# Altium project pca10171.PrjPCB (part 2 of 4)

## Sheet pca10171_interface_mcu.SchDoc: =BoardTitle + ' - Interface MCU'
size A3; Organization: Nordic Semiconductor; DocumentNumber: 3; Revision: 1.0.1; SheetNumber: 3; SheetTotal: 10; Author: KOD1; CompanyName: Nordic Semiconductor; DrawnBy: KOD1; DocumentSize: A3; ProjectName: nRF91 DK
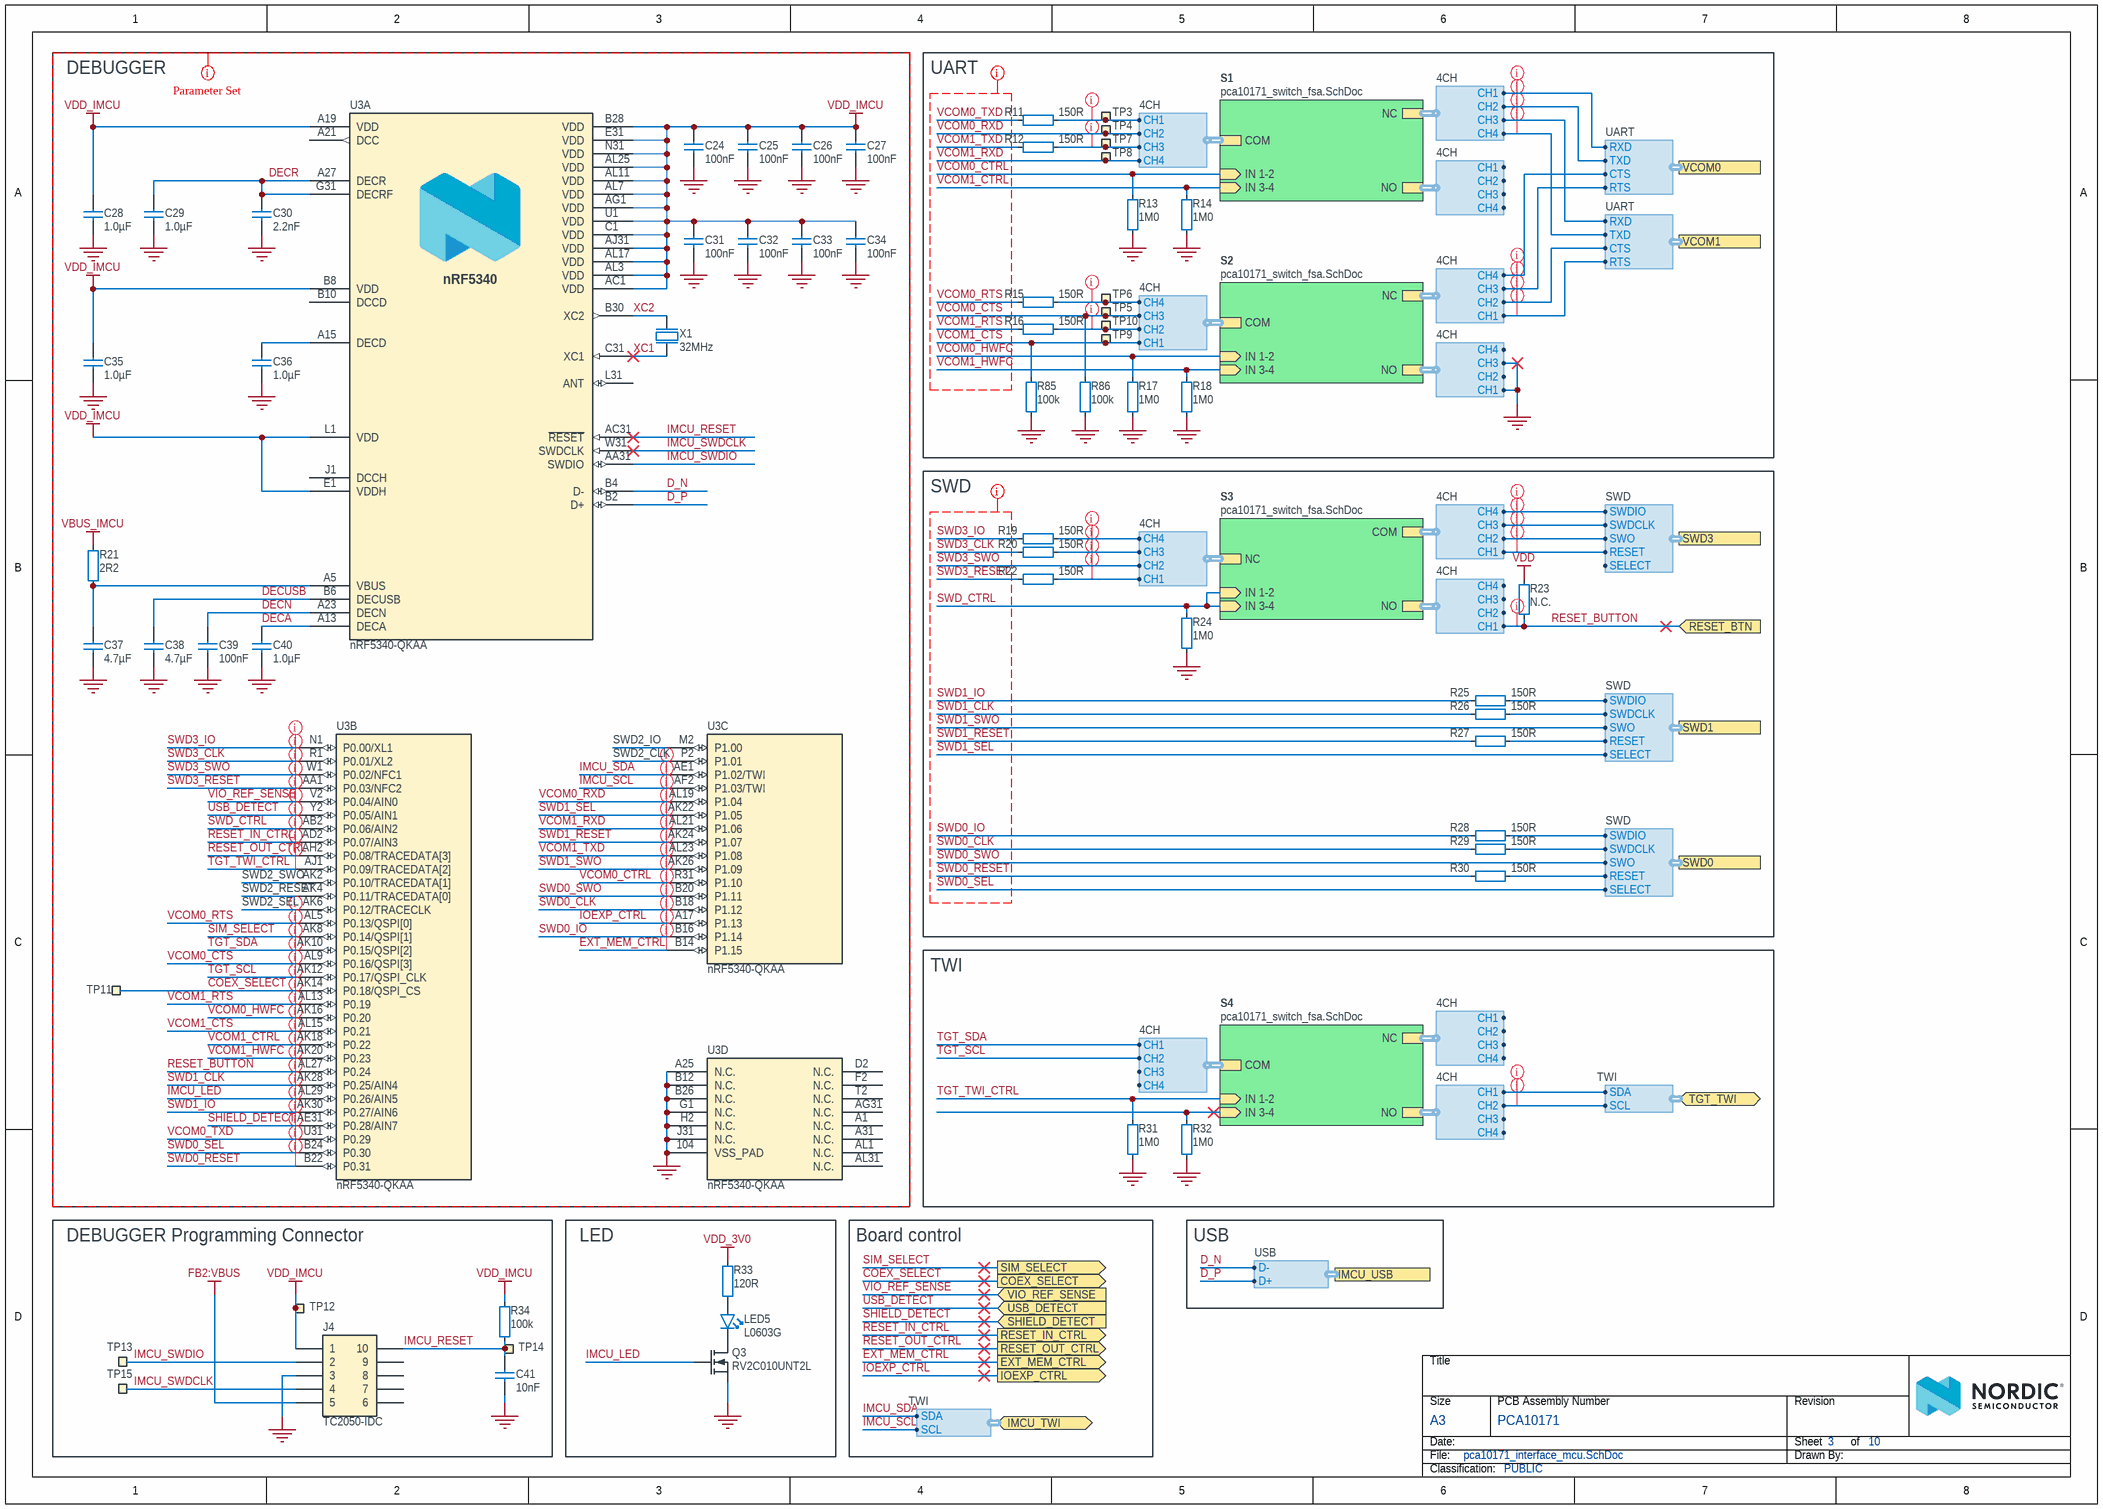
[diagram p2: pca10171_interface_mcu.SchDoc]

### Parts
C24  100nF  [CAPC0603X03L_C]
C25  100nF  [CAPC0603X03L_C]
C26  100nF  [CAPC0603X03L_C]
C27  100nF  [CAPC0603X03L_C]
C28  1.0µF  [CAPC1005X04L]
C29  1.0µF  [CAPC1005X04L]
C30  2.2nF  [CAPC0603X03L_C]
C31  100nF  [CAPC0603X03L_C]
C32  100nF  [CAPC0603X03L_C]
C33  100nF  [CAPC0603X03L_C]
C34  100nF  [CAPC0603X03L_C]
C35  1.0µF  [CAPC1005X04L]
C36  1.0µF  [CAPC1005X04L]
C37  4.7µF  [CAPC1608X06L]
C38  4.7µF  [CAPC1608X06L]
C39  100nF  [CAPC0603X03L_C]
C40  1.0µF  [CAPC1005X04L]
C41  10nF  [CAPC0603X03L_C]
J4  TC2050-IDC  [TC2050-IDC-NLFP]  (no BOM)
LED5  L0603G  [LED_0603_G]
Q3  RV2C010UNT2L  [DFN65P100X40-3L]
R11  150R  [RESC0603X03L_C]
R12  150R  [RESC0603X03L_C]
R13  1M0  [RESC0603X03L_C]
R14  1M0  [RESC0603X03L_C]
R15  150R  [RESC0603X03L_C]
R16  150R  [RESC0603X03L_C]
R17  1M0  [RESC0603X03L_C]
R18  1M0  [RESC0603X03L_C]
R19  150R  [RESC0603X03L_C]
R20  150R  [RESC0603X03L_C]
R21  2R2  [RESC0603X03L_C]
R22  150R  [RESC0603X03L_C]
R23  N.C.  [RESC0603X03L_C_NC]
R24  1M0  [RESC0603X03L_C]
R25  150R  [RESC0603X03L_C]
R26  150R  [RESC0603X03L_C]
R27  150R  [RESC0603X03L_C]
R28  150R  [RESC0603X03L_C]
R29  150R  [RESC0603X03L_C]
R30  150R  [RESC0603X03L_C]
R31  1M0  [RESC0603X03L_C]
R32  1M0  [RESC0603X03L_C]
R33  120R  [RESC0603X03L_C]
R34  100k  [RESC0603X03L_C]
R85  100k  [RESC0603X03L_C]
R86  100k  [RESC0603X03L_C]
TP3  Ø1.5mm,SMD  [TP_SMD_D1.5mm]  (value not drawn)  (no BOM)
TP4  Ø1.5mm,SMD  [TP_SMD_D1.5mm]  (value not drawn)  (no BOM)
TP5  Ø1.5mm,SMD  [TP_SMD_D1.5mm]  (value not drawn)  (no BOM)
TP6  Ø1.5mm,SMD  [TP_SMD_D1.5mm]  (value not drawn)  (no BOM)
TP7  Ø1.5mm,SMD  [TP_SMD_D1.5mm]  (value not drawn)  (no BOM)
TP8  Ø1.5mm,SMD  [TP_SMD_D1.5mm]  (value not drawn)  (no BOM)
TP9  Ø1.5mm,SMD  [TP_SMD_D1.5mm]  (value not drawn)  (no BOM)
TP10  Ø1.5mm,SMD  [TP_SMD_D1.5mm]  (value not drawn)  (no BOM)
TP11  Ø1.5mm,SMD  [TP_SMD_D1.5mm]  (value not drawn)  (no BOM)
TP12  Ø1.5mm,SMD  [TP_SMD_D1.5mm]  (value not drawn)  (no BOM)
TP13  Ø1.5mm,SMD  [TP_SMD_D1.5mm]  (value not drawn)  (no BOM)
TP14  Ø1.5mm,SMD  [TP_SMD_D1.5mm]  (value not drawn)  (no BOM)
TP15  Ø1.5mm,SMD  [TP_SMD_D1.5mm]  (value not drawn)  (no BOM)
U3  nRF5340-QKAA  [AQFN40P700X700X85_HS-99N]  (parts A,B,C,D of 4)
X1  32MHz  [BT-XTAL_2016]

### Blocks framed on the sheet
DEBUGGER: C24-C40 R21 TP11 U3 X1
UART: R11-R18 R85 R86 TP3-TP10
SWD: R19 R20 R22-R30
TWI: R31 R32
DEBUGGER Programming Connector: C41 J4 R34 TP12-TP15
LED: LED5 Q3 R33

### Sub-sheets
S1 = pca10171_switch_fsa.SchDoc: IN 1-2 (in), COM (harness 4CH), NC (harness 4CH), NO (harness 4CH), IN 3-4 (in)
S2 = pca10171_switch_fsa.SchDoc: IN 1-2 (in), COM (harness 4CH), NC (harness 4CH), NO (harness 4CH), IN 3-4 (in)
S3 = pca10171_switch_fsa.SchDoc: IN 1-2 (in), COM (harness 4CH), NC (harness 4CH), NO (harness 4CH), IN 3-4 (in)
S4 = pca10171_switch_fsa.SchDoc: IN 1-2 (in), COM (harness 4CH), NC (harness 4CH), NO (harness 4CH), IN 3-4 (in)

### Ports
COEX_SELECT (out), EXT_MEM_CTRL (out), IMCU_TWI (bidir, harness TWI), IMCU_USB (harness USB), IOEXP_CTRL (out), RESET_BTN (in), RESET_IN_CTRL (out), RESET_OUT_CTRL (out), SHIELD_DETECT (in), SIM_SELECT (out), SWD0 (harness SWD), SWD1 (harness SWD), SWD3 (harness SWD), TGT_TWI (bidir, harness TWI), USB_DETECT (in), VCOM0 (harness UART), VCOM1 (harness UART), VIO_REF_SENSE (in)

### Harnesses
TWI: SCL, SDA
SWD: SWDIO, SWDCLK, SWO, RESET, SELECT
USB: D+, D-
4CH: CH1, CH2, CH3, CH4
UART: RTS, CTS, RXD, TXD

### Nets
FB2:VBUS: J4.5
GND: C24.1 C25.1 C26.2 C27.1 C28.2 C29.1 C30.2 C31.1 C32.1 C33.1 C34.2 C35.1 C36.1 C37.2 C38.2 C39.2 C40.1 C41.1 J4.3 Q3.2(S) R13.2 R14.1 R17.2 R18.1 R24.1 R31.2 R32.1 R85.2 R86.2 U3.104(VSS_PAD) U3.A25(N.C.) U3.B12(N.C.) U3.B26(N.C.) U3.G1(N.C.) U3.H2(N.C.) U3.J31(N.C.) X1.2(GND) X1.4(GND) ; sheet S2/NO.CH1, sheet S2/NO.CH3
VBUS_IMCU: R21.1  [project net VBUS]
VDD: R23.2
VDD_3V0: R33.2
VDD_IMCU: C24.2 C25.2 C26.1 C27.2 C28.1 C31.2 C32.2 C33.2 C34.1 C35.2 J4.1 R34.2 TP12.1 U3.A19(VDD) U3.AC1(VDD) U3.AG1(VDD) U3.AJ31(VDD) U3.AL3(VDD) U3.AL7(VDD) U3.AL11(VDD) U3.AL17(VDD) U3.AL25(VDD) U3.B8(VDD) U3.B28(VDD) U3.C1(VDD) U3.E1(VDDH) U3.E31(VDD) U3.L1(VDD) U3.N31(VDD) U3.U1(VDD)
COEX_SELECT: TP11.1 U3.AK14(P0.18/QSPI_CS) ; port COEX_SELECT
D_N: U3.B4(D-) ; port IMCU_USB.D-
D_P: U3.B2(D+) ; port IMCU_USB.D+
DECA: C40.2 U3.A13(DECA)
DECN: C39.1 U3.A23(DECN)
DECR: C29.2 C30.1 U3.A27(DECR) U3.G31(DECRF)
DECUSB: C38.1 U3.B6(DECUSB)
EXT_MEM_CTRL: U3.B14(P1.15) ; port EXT_MEM_CTRL
IMCU_LED: Q3.1(G) U3.AL29(P0.26/AIN5)
IMCU_RESET: C41.2 J4.10 R34.1 TP14.1 U3.AC31(~{RESET})
IMCU_SCL: U3.AF2(P1.03/TWI) ; port IMCU_TWI.SCL
IMCU_SDA: U3.AE1(P1.02/TWI) ; port IMCU_TWI.SDA
IMCU_SWDCLK: J4.4 TP15.1 U3.W31(SWDCLK)
IMCU_SWDIO: J4.2 TP13.1 U3.AA31(SWDIO)
IN 3-4: R32.2 ; sheet S4/IN 3-4
IOEXP_CTRL: U3.A17(P1.13) ; port IOEXP_CTRL
P0.22: sheet S3/COM.CH2, port SWD3.SWO
P0.30: port TGT_TWI.SDA, sheet S4/NO.CH1
P0.31: port TGT_TWI.SCL, sheet S4/NO.CH2
RESET: sheet S3/COM.CH1, port SWD3.RESET
RESET_BUTTON: R23.1 U3.AL27(P0.24) ; port RESET_BTN, sheet S3/NO.CH1
RESET_IN_CTRL: U3.AD2(P0.07/AIN3) ; port RESET_IN_CTRL
RESET_OUT_CTRL: U3.AH2(P0.08/TRACEDATA[3]) ; port RESET_OUT_CTRL
SHIELD_DETECT: U3.AE31(P0.28/AIN7) ; port SHIELD_DETECT
SIM_SELECT: U3.AK8(P0.14/QSPI[1]) ; port SIM_SELECT
SWD0_CLK: R29.1 U3.B18(P1.12)
SWD0_IO: R28.1 U3.B16(P1.14)
SWD0_RESET: R30.1 U3.B22(P0.31)
SWD0_SEL: U3.B24(P0.30) ; port SWD0.SELECT
SWD0_SWO: U3.B20(P1.11) ; port SWD0.SWO
SWD1_CLK: R26.1 U3.AK28(P0.25/AIN4)
SWD1_IO: R25.1 U3.AK30(P0.27/AIN6)
SWD1_RESET: R27.1 U3.AK24(P1.07)
SWD1_SEL: U3.AK22(P1.05) ; port SWD1.SELECT
SWD1_SWO: U3.AK26(P1.09) ; port SWD1.SWO
SWD3_CLK: R20.1 U3.R1(P0.01/XL2)
SWD3_IO: R19.1 U3.N1(P0.00/XL1)
SWD3_RESET: R22.1 U3.AA1(P0.03/NFC2)
SWD3_SWO: U3.W1(P0.02/NFC1) ; sheet S3/NC.CH2
SWD_CTRL: R24.2 U3.AB2(P0.06/AIN2) ; sheet S3/IN 1-2, sheet S3/IN 3-4
SWDCLK: sheet S3/COM.CH3, port SWD3.SWDCLK
SWDIO: sheet S3/COM.CH4, port SWD3.SWDIO
TGT_SCL: U3.AK12(P0.17/QSPI_CLK) ; sheet S4/COM.CH2
TGT_SDA: U3.AK10(P0.15/QSPI[2]) ; sheet S4/COM.CH1
TGT_TWI_CTRL: R31.1 U3.AJ1(P0.09/TRACEDATA[2]) ; sheet S4/IN 1-2
USB_DETECT: U3.Y2(P0.05/AIN1) ; port USB_DETECT
VCOM0_CTRL: R13.1 U3.R31(P1.10) ; sheet S1/IN 1-2
VCOM0_CTS: R86.1 TP5.1 U3.AL9(P0.16/QSPI[3]) ; sheet S2/COM.CH3
VCOM0_HWFC: R17.1 U3.AK16(P0.20) ; sheet S2/IN 1-2
VCOM0_RTS: R15.1 U3.AL5(P0.13/QSPI[0])
VCOM0_RXD: TP4.1 U3.AL19(P1.04) ; sheet S1/COM.CH2
VCOM0_TXD: R11.1 U3.U31(P0.29)
VCOM1_CTRL: R14.2 U3.AK18(P0.22) ; sheet S1/IN 3-4
VCOM1_CTS: R85.1 TP9.1 U3.AL15(P0.21) ; sheet S2/COM.CH1
VCOM1_HWFC: R18.2 U3.AK20(P0.23) ; sheet S2/IN 3-4
VCOM1_RTS: R16.1 U3.AL13(P0.19)
VCOM1_RXD: TP8.1 U3.AL21(P1.06) ; sheet S1/COM.CH4
VCOM1_TXD: R12.1 U3.AL23(P1.08)
VIO_REF_SENSE: U3.V2(P0.04/AIN0) ; port VIO_REF_SENSE
XC1: U3.C31(XC1) X1.1(inp)
XC2: U3.B30(XC2) X1.3(out)
NetC36_2: C36.2 U3.A15(DECD)
NetC37_1: C37.1 R21.2 U3.A5(VBUS)
NetLED5_1: LED5.1(C) Q3.3(D)
NetLED5_2: LED5.2(A) R33.1
NetP19_2: R28.2 ; port SWD0.SWDIO
NetP19_4: R29.2 ; port SWD0.SWDCLK
NetP19_10: R30.2 ; port SWD0.RESET
NetP20_4: R25.2 ; port SWD1.SWDIO
NetP20_5: R26.2 ; port SWD1.SWDCLK
NetP20_7: R27.2 ; port SWD1.RESET
NetP29_2: port VCOM0.RTS, sheet S2/NC.CH3
NetP29_4: sheet S1/NC.CH1, port VCOM0.RXD
NetP29_5: sheet S1/NC.CH2, port VCOM0.TXD
NetP29_6: port VCOM0.CTS, sheet S2/NC.CH4
NetR11_2: R11.2 TP3.1 ; sheet S1/COM.CH1
NetR12_2: R12.2 TP7.1 ; sheet S1/COM.CH3
NetR15_2: R15.2 TP6.1 ; sheet S2/COM.CH4
NetR16_2: R16.2 TP10.1 ; sheet S2/COM.CH2
NetR19_2: R19.2 ; sheet S3/NC.CH4
NetR20_2: R20.2 ; sheet S3/NC.CH3
NetR22_2: R22.2 ; sheet S3/NC.CH1
NetSB7_2: sheet S1/NC.CH3, port VCOM1.RXD
NetSB8_2: sheet S1/NC.CH4, port VCOM1.TXD
NetSB9_2: port VCOM1.RTS, sheet S2/NC.CH1
NetSB10_2: port VCOM1.CTS, sheet S2/NC.CH2

Not connected (* = marked no-connect by the designer): J4 6 7 8 9; U3 A1(N.C.) A21(DCC) A31(N.C.) AG31(N.C.) AK2(P0.10/TRACEDATA[1]) AK4(P0.11/TRACEDATA[0]) AK6(P0.12/TRACECLK) AL1(N.C.) AL31(N.C.) B10(DCCD) D2(N.C.) F2(N.C.) J1(DCCH) L31(ANT) M2(P1.00) P2(P1.01) T2(N.C.)

### Layout directives
net class GPIO: COEX_SELECT, EXT_MEM_CTRL, IMCU_LED, IMCU_SCL, IMCU_SDA, IOEXP_CTRL, NetP29_2, NetP29_4, NetP29_5, NetP29_6, NetR11_2, NetR12_2, NetR15_2, NetR16_2, NetR19_2, NetR20_2, NetR22_2, NetSB7_2, NetSB8_2, NetSB9_2, NetSB10_2, P0.22, P0.30, P0.31, RESET, RESET_BUTTON, RESET_IN_CTRL, RESET_OUT_CTRL, SHIELD_DETECT, SIM_SELECT, SWD0_CLK, SWD0_IO, SWD0_RESET, SWD0_SEL, SWD0_SWO, SWD1_CLK, SWD1_IO, SWD1_RESET, SWD1_SEL, SWD1_SWO, SWD3_CLK, SWD3_IO, SWD3_RESET, SWD3_SWO, SWD_CTRL, SWDCLK, SWDIO, TGT_SCL, TGT_SDA, TGT_TWI_CTRL, USB_DETECT, VCOM0_CTRL, VCOM0_CTS, VCOM0_HWFC, VCOM0_RTS, VCOM0_RXD, VCOM0_TXD, VCOM1_CTRL, VCOM1_CTS, VCOM1_HWFC, VCOM1_RTS, VCOM1_RXD, VCOM1_TXD, VIO_REF_SENSE
CompClassName: IMCU: COEX_SELECT, D_N, D_P, DECA, DECN, DECR, DECUSB, EXT_MEM_CTRL, GND, IMCU_LED, IMCU_RESET, IMCU_SCL, IMCU_SDA, IMCU_SWDCLK, IMCU_SWDIO, IOEXP_CTRL, RESET_BUTTON, RESET_IN_CTRL, RESET_OUT_CTRL, SHIELD_DETECT, SIM_SELECT, SWD0_CLK, SWD0_IO, SWD0_RESET, SWD0_SEL, SWD0_SWO, SWD1_CLK, SWD1_IO, SWD1_RESET, SWD1_SEL, SWD1_SWO, SWD3_CLK, SWD3_IO, SWD3_RESET, SWD3_SWO, SWD_CTRL, TGT_SCL, TGT_SDA, TGT_TWI_CTRL, USB_DETECT, VBUS_IMCU, VCOM0_CTRL, VCOM0_CTS, VCOM0_HWFC, VCOM0_RTS, VCOM0_RXD, VCOM0_TXD, VCOM1_CTRL, VCOM1_CTS, VCOM1_HWFC, VCOM1_RTS, VCOM1_RXD, VCOM1_TXD, VDD_IMCU, VIO_REF_SENSE, XC1, XC2
net class VCOM: VCOM0_CTRL, VCOM0_CTS, VCOM0_HWFC, VCOM0_RTS, VCOM0_RXD, VCOM0_TXD, VCOM1_CTRL, VCOM1_CTS, VCOM1_HWFC, VCOM1_RTS, VCOM1_RXD, VCOM1_TXD
net class SWD: SWD0_CLK, SWD0_IO, SWD0_RESET, SWD0_SEL, SWD0_SWO, SWD1_CLK, SWD1_IO, SWD1_RESET, SWD1_SEL, SWD1_SWO, SWD3_CLK, SWD3_IO, SWD3_RESET, SWD3_SWO, SWD_CTRL

### Notes on the sheet
- (near U3) SWD2_IO
- (near U3) SWD2_CLK
- (near U3) SWD2_SWO
- (near U3) SWD2_RESET
- (near U3) SWD2_SEL
- Board control
- USB
- Title
- Size
- Date:
- File:
- A3
- PCB Assembly Number
- Sheet         of
- Drawn By:
- Revision
- Classification:
- (in symbol nRF5340-QKAAD0, part A) nRF5340

### Library data of the parts
C24-C27 C31-C33 = C0201-100n: as C4 on sheet pca10171_nrf9151; Part Number: C0201-100n; Manufacturer Part Number: N.A.; ComponentLink1URL: N.A.; ComponentLink1Description: Datasheet; ComponentLink2URL: N.A.; ComponentLink2Description: Supplier link; HelpURL: N.A.; Footprint Doc: 0201; LatestRevisionDate: 2017-11-09; Published: 2014-11-13; Value: 100nF; Artikkelnr Noca: N.A.; Supplier 1: N.A.; Supplier Part Number 1: N.A.; Supplier 2: N.A.; Supplier Part Number 2: N.A.; PartId: 100200078; Component Class: Capacitors; Author: rsk
C28 C29 C35 C36 C40 = C0402-1µ0-10V-X5R: Capacitor, Ceramic, X5R, ±10%, 10V; Manufacturer: N.A.; Part number NEMS: 100200482; Pad Count: 2; Component Status: Active; Part Number: C0402-1µ0-10V-X5R; Value: 1.0µF; Footprint Doc: 0402; Component Class: Capacitors; Author: rubr; PartId: 100200482; Manufacturer Part Number: N.A.; ComponentLink1URL: N.A.; ComponentLink1Description: Datasheet; ComponentLink2URL: N.A.; ComponentLink2Description: Supplier link; HelpURL: N.A.; LatestRevisionDate: 2021-07-22; Published: 2021-07-22; Note: 10V; Supplier 1: N.A.; Supplier Part Number 1: N.A.; Supplier 2: N.A.; Supplier Part Number 2: N.A.; Artikkelnr Noca: N.A.; Part number IPS: N.A.; Part number Norautron: N.A.
C30 = C0201-2n2: Capacitor, X7R, ±10%, 10V; Manufacturer: N.A.; Part number IPS: 00000001778; Part number Norautron: 26470002; Part number NEMS: 100200060; Pad Count: 2; Component Status: Active; Part Number: C0201-2n2; Value: 2.2nF; Footprint Doc: 0201; Component Class: Capacitors; Author: rsk; PartId: 100200060; Manufacturer Part Number: N.A.; ComponentLink1URL: N.A.; ComponentLink1Description: Datasheet; ComponentLink2URL: N.A.; ComponentLink2Description: Supplier link; HelpURL: N.A.; LatestRevisionDate: 2014-11-13; Published: 2014-11-13; Note: 10V; Supplier 1: N.A.; Supplier Part Number 1: N.A.; Supplier 2: N.A.; Supplier Part Number 2: N.A.; Artikkelnr Noca: N.A.
C34 C39 = C0201-100n: Capacitor, X5R, ±10%; Manufacturer: N.A.; Part number IPS: 00000001248, 00000002505; Part number Norautron: 262071862; Part number NEMS: 100200078; Pad Count: 2; Note: 16V; Component Status: Active; Part Number: C0201-100n; Value: 100nF; Footprint Doc: 0201; Component Class: Capacitors; Author: rsk; PartId: 100200078; Manufacturer Part Number: N.A.; ComponentLink1URL: N.A.; ComponentLink1Description: Datasheet; ComponentLink2URL: N.A.; ComponentLink2Description: Supplier link; HelpURL: N.A.; LatestRevisionDate: 2017-11-09; Published: 2014-11-13; Supplier 1: N.A.; Supplier Part Number 1: N.A.; Supplier 2: N.A.; Supplier Part Number 2: N.A.; Artikkelnr Noca: N.A.
C37 C38 = C0603-4µ7-10V-X5R: Capacitor, Ceramic, X5R, ±10%, 10V; Manufacturer: N.A.; Part number Norautron: 262081761; Part number NEMS: 100200479; Pad Count: 2; Component Status: Active; Part Number: C0603-4µ7-10V-X5R; Manufacturer Part Number: N.A.; ComponentLink1URL: N.A.; ComponentLink1Description: Datasheet; ComponentLink2URL: N.A.; ComponentLink2Description: Supplier link; HelpURL: N.A.; Footprint Doc: 0603; LatestRevisionDate: 2021-07-22; Published: 2021-07-22; Value: 4.7µF; Note: 10V; Artikkelnr Noca: N.A.; Part number IPS: N.A.; Supplier 1: N.A.; Supplier Part Number 1: N.A.; Supplier 2: N.A.; Supplier Part Number 2: N.A.; PartId: 100200479; Component Class: Capacitors; Author: rubr
C41 = C0201-10n: Capacitor, X7R, ±10%; Manufacturer: N.A.; Part number IPS: 00000003480; Part number Norautron: 26621779; Part number NEMS: 100200067; Note: 10V; Pad Count: 2; Component Status: Active; Part Number: C0201-10n; Manufacturer Part Number: N.A.; ComponentLink1URL: N.A.; ComponentLink1Description: Datasheet; ComponentLink2URL: N.A.; ComponentLink2Description: Supplier link; HelpURL: N.A.; Footprint Doc: 0201; LatestRevisionDate: 2017-11-09; Published: 2014-11-13; Value: 10nF; Supplier 1: N.A.; Supplier Part Number 1: N.A.; Supplier 2: N.A.; Supplier Part Number 2: N.A.; Artikkelnr Noca: N.A.; PartId: 100200067; Component Class: Capacitors; Author: rsk
J4 = TC2050-IDC-NLFP: CBL PLUG-OF-NAILS 10-PIN; Manufacturer: Tag-Connect LLC; Part number NEMS: 100500463; Artikkelnr Noca: N.A.; Pad Count: 10; Component Status: Active; System: Connector; Part Number: TC2050-IDC-NLFP; Manufacturer Part Number: TC2050-IDC-NLFP; LatestRevisionDate: 2012-11-21; Published: 2012-11-21; Value: TC2050-IDC; Footprint Doc: TC2050-IDC-NLFP; Part number IPS: N.A.; ComponentLink1URL: N.A.; ComponentLink1Description: Datasheet; ComponentLink2URL: N.A.; ComponentLink2Description: Supplier link; HelpURL: http://www.tag-connect.com/Materials/TC2050-IDC%20Datasheet.pdf; Supplier 1: Digi-Key; Supplier Part Number 1: TC2050-IDC-NL-ND; Supplier 2: N.A.; Supplier Part Number 2: N.A.; PartId: 100500463; Component Class: Connectors; Note: N.A.; Author: rsk; Part number Norautron: N.A.
LED5 = VS 25C7M5: LED, Green, 0603, 573nm, Vf=2.0V, 24mcd, - 40 to +85°C; Manufacturer: Victory Electronics; Part number IPS: 00000001274, 00000009961; Part number Norautron: 26313411; Part number NEMS: 101400097; Note: N.A.; Artikkelnr Noca: 13019193; Pad Count: 2; Component Status: Active; Part Number: VS 25C7M5; Manufacturer Part Number: VS 25C7M5; Footprint Doc: 0603; LatestRevisionDate: 2020-10-23; Published: 2017-08-21; Value: L0603G; ComponentLink1URL: N.A.; ComponentLink1Description: Datasheet; ComponentLink2URL: N.A.; ComponentLink2Description: Supplier link; HelpURL: \\hizz\pro\app9717\Datasheet\optoelectronics\Victory Electronics\VS 25C7M5.pdf; Supplier 1: EC Partner; Supplier Part Number 1: N.A.; Supplier 2: N.A.; Supplier Part Number 2: N.A.; PartId: 101400097; Component Class: Optoelectronics; Author: rsk
Q3 = RV2C010UNT2L: N-Channel MOSFET, 20V, 1A, 470mOhm, 400mW; Manufacturer: Rohm Semiconductor; Part number IPS: 00000009976; Part number Norautron: 26320026; Part number NEMS: 101300132; Note: N.A.; Artikkelnr Noca: 35010020; Pad Count: 3; Component Status: Active; Part Number: RV2C010UNT2L; Manufacturer Part Number: RV2C010UNT2L; ComponentLink1URL: N.A.; ComponentLink1Description: Datasheet; ComponentLink2URL: N.A.; ComponentLink2Description: Supplier link; HelpURL: http://rohmfs.rohm.com/en/products/databook/datasheet/discrete/transistor/mosfet/rv2c010unt2l-e.pdf; Footprint Doc: DFN-3; LatestRevisionDate: 2016-08-09; Published: 2016-08-09; Value: RV2C010UNT2L; Supplier 1: Digi-Key; Supplier Part Number 1: RV2C010UNT2LCT-ND; Supplier 2: Mouser; Supplier Part Number 2: 755-RV2C010UNT2L; PartId: 101300132; Component Class: Semiconductors; Author: rsk
R11 R12 R15 R16 R19 R20 R22 R25-R30 = R0201-150: Resistor, ±1%, 0.05W; Manufacturer: N.A.; Part number IPS: 00000001420; Part number NEMS: 100100029; Note: Chip Res 1%; Pad Count: 2; Component Status: Active; Part Number: R0201-150; Manufacturer Part Number: N.A.; ComponentLink1URL: N.A.; ComponentLink1Description: Datasheet; ComponentLink2URL: N.A.; ComponentLink2Description: Supplier link; HelpURL: N.A.; Footprint Doc: 0201; LatestRevisionDate: 2014-11-13; Published: 2014-11-13; Value: 150R; Artikkelnr Noca: N.A.; Supplier 1: N.A.; Supplier Part Number 1: N.A.; Supplier 2: N.A.; Supplier Part Number 2: N.A.; PartId: 100100029; Component Class: Resistors; Author: rsk; Part number Norautron: N.A.
R13 R14 R17 R18 R24 R31 R32 = R0201-1M0: as R3 on sheet pca10171_nrf9151; Part Number: R0201-1M0; Manufacturer Part Number: N.A.; ComponentLink1URL: N.A.; ComponentLink1Description: Datasheet; ComponentLink2URL: N.A.; ComponentLink2Description: Supplier link; HelpURL: N.A.; Footprint Doc: 0201; LatestRevisionDate: 2014-11-13; Published: 2014-11-13; Value: 1M0; Artikkelnr Noca: N.A.; Supplier 1: N.A.; Supplier Part Number 1: N.A.; Supplier 2: N.A.; Supplier Part Number 2: N.A.; PartId: 100100093; Component Class: Resistors; Author: rsk
R21 = R0201-2R2: Resistor, ±1%, 0.05W; Manufacturer: N.A.; Part number Norautron: 26470029; Part number NEMS: 100100006; Pad Count: 2; Note: Chip Res 1%; Component Status: Active; Part Number: R0201-2R2; Footprint Doc: 0201; Value: 2R2; Component Class: Resistors; Author: rsk; PartId: 100100006; Manufacturer Part Number: N.A.; ComponentLink1URL: N.A.; ComponentLink1Description: Datasheet; ComponentLink2URL: N.A.; ComponentLink2Description: Supplier link; HelpURL: N.A.; LatestRevisionDate: 2014-11-13; Published: 2014-11-13; Supplier 1: N.A.; Supplier Part Number 1: N.A.; Supplier 2: N.A.; Supplier Part Number 2: N.A.; Artikkelnr Noca: N.A.; Part number IPS: N.A.
R23 = R0201-N.C.: Not mounted; Manufacturer: N.A.; Part number NEMS: 100100107; Note: Chip Res; Assembly: Not mounted; Pad Count: 2; Component Status: Active; Part Number: R0201-N.C.; Manufacturer Part Number: N.A.; Footprint Doc: 0201; LatestRevisionDate: 2014-11-13; Published: 2014-11-13; Value: N.C.; Artikkelnr Noca: N.A.; Part number IPS: N.A.; ComponentLink1URL: N.A.; ComponentLink1Description: Datasheet; ComponentLink2URL: N.A.; ComponentLink2Description: Supplier link; HelpURL: N.A.; Supplier 1: N.A.; Supplier Part Number 1: N.A.; Supplier 2: N.A.; Supplier Part Number 2: N.A.; Author: rsk; Component Class: Resistors; PartId: 100100107; Part number Norautron: N.A.
R33 = R0201-120: Resistor, ±1%, 0.05W; Manufacturer: N.A.; Part number IPS: 00000000880; Part number Norautron: 26107076; Part number NEMS: 100100028; Note: Chip Res 1%; Pad Count: 2; Component Status: Active; Part Number: R0201-120; Manufacturer Part Number: N.A.; ComponentLink1URL: N.A.; ComponentLink1Description: Datasheet; ComponentLink2URL: N.A.; ComponentLink2Description: Supplier link; HelpURL: N.A.; Footprint Doc: 0201; LatestRevisionDate: 2014-11-13; Published: 2014-11-13; Value: 120R; Supplier 1: N.A.; Supplier Part Number 1: N.A.; Supplier 2: N.A.; Supplier Part Number 2: N.A.; Artikkelnr Noca: N.A.; PartId: 100100028; Component Class: Resistors; Author: rsk
R34 R85 R86 = R0201-100k: Resistor, ±1%, 0.05W; Manufacturer: N.A.; Part number IPS: 00000001419; Part number Norautron: 26108487; Part number NEMS: 100100080; Note: Chip Res 1%; Pad Count: 2; Component Status: Active; Part Number: R0201-100k; Manufacturer Part Number: N.A.; ComponentLink1URL: N.A.; ComponentLink1Description: Datasheet; ComponentLink2URL: N.A.; ComponentLink2Description: Supplier link; HelpURL: N.A.; Footprint Doc: 0201; LatestRevisionDate: 2014-11-13; Published: 2014-11-13; Value: 100k; Artikkelnr Noca: N.A.; Supplier 1: N.A.; Supplier Part Number 1: N.A.; Supplier 2: N.A.; Supplier Part Number 2: N.A.; PartId: 100100080; Component Class: Resistors; Author: rsk
TP3-TP15 = TP_SMD_Ø1.5MM: 1.5mm circular SMD testpad; Manufacturer: Nordic Semiconductor; Manufacturer Part Number: N.A.; Part number NEMS: 100500477; Pad Count: 1; Component Status: Active; Part Number: TP_SMD_Ø1.5MM; LatestRevisionDate: 2021-03-05; Published: 2016-06-02; Value: Ø1.5mm,SMD; Note: N.A.; Artikkelnr Noca: N.A.; Footprint Doc: TP_SMD_Ø1.5mm; Part number IPS: N.A.; ComponentLink1URL: N.A.; ComponentLink1Description: Datasheet; ComponentLink2URL: N.A.; ComponentLink2Description: Supplier link; HelpURL: N.A.; Supplier 1: N.A.; Supplier Part Number 1: N.A.; Supplier 2: N.A.; Supplier Part Number 2: N.A.; PartId: 100500477; Component Class: Connectors; Author: rsk; Part number Norautron: N.A.
U3 = nRF5340-QKAAD0: Multi-protocol Bluetooth Low Energy, IEEE 802.15.4, ANT and 2.4GHz proprietary system-on-chip; Manufacturer: Nordic Semiconductor; Part number Norautron: NOD26470035; Part number NEMS: 102000216; Pad Count: 98; Note: N.A.; Component Status: Active; Part Number: nRF5340-QKAAD0; PartId: 102000216; Component Class: Nordic_Devices; Author: rsk; Manufacturer Part Number: nRF5340-QKAAD0; ComponentLink1URL: N.A.; ComponentLink1Description: Datasheet; ComponentLink2URL: N.A.; ComponentLink2Description: Supplier link; HelpURL: N.A.; Footprint Doc: AQFN-98; LatestRevisionDate: 2020-12-02; Published: 2020-12-02; Value: nRF5340-QKAA; Supplier 1: Nordic Semiconductor; Supplier Part Number 1: nRF5340-QKAAD0; Supplier 2: N.A.; Supplier Part Number 2: N.A.; Artikkelnr Noca: N.A.; Part number IPS: N.A.
X1 = XTAL_SMD2016_32MHz_8pF_Kyocera: XTAL SMD 2016, 32MHz, Cl=8pF, Tot: ±40ppm; Manufacturer Part Number: CX2016DB32000D0WZRC1; Part number IPS: 00000007827; Part number Norautron: 26511136; Part number NEMS: 101600039; Pad Count: 4; Note: XTAL SMD 32.000MHz; Artikkelnr Noca: 22010022; Component Status: Active; Part Number: XTAL_SMD2016_32MHz_8pF_Kyocera; Value: 32MHz; Footprint Doc: XTAL_2016; Component Class: Oscillators; Author: rsk; PartId: 101600039; Manufacturer: Kyocera; ComponentLink1URL: N.A.; ComponentLink1Description: Datasheet; ComponentLink2URL: N.A.; ComponentLink2Description: Supplier link; HelpURL: http://media.digikey.com/pdf/Data%20Sheets/AVX%20PDFs/CX2016DB32000D0WZRC1_Spec.pdf; LatestRevisionDate: 2016-06-02; Published: 2015-10-15; Supplier 1: Digi-Key; Supplier Part Number 1: 1253-1586-1-ND; Supplier 2: N.A.; Supplier Part Number 2: N.A.

## Sheet pca10171_switch_fsa.SchDoc: =BoardTitle + ' - Switch FSA'
size A3; Organization: Nordic Semiconductor; DocumentNumber: 9; Revision: 1.0.1; SheetNumber: 9; SheetTotal: 10; Author: KOD1; CompanyName: Nordic Semiconductor; DrawnBy: KOD1; DocumentSize: A4; ProjectName: nRF91 DK
Used 9 times, as channels /S1, /S2, /S3, /S4, /S5, /S6, /S8, /S10, /S11. Parts and nets are listed once, with the designators drawn on the sheet.
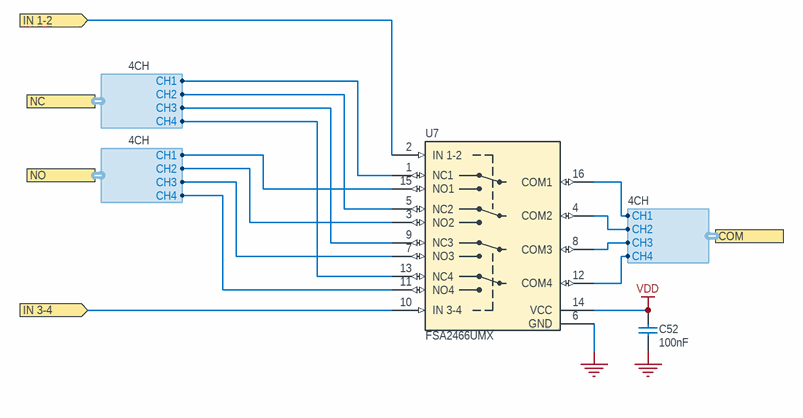
[diagram p3: pca10171_switch_fsa.SchDoc]

### Parts
C52  100nF  [CAPC0603X03L_C]
U7  FSA2466UMX  [XQFN40P180X260X50-16N]

### Ports
COM (harness 4CH), IN 1-2 (in), IN 3-4 (in), NC (harness 4CH), NO (harness 4CH)

### Harnesses
4CH: CH1, CH2, CH3, CH4

### Nets
GND: C52.2 U7.6(GND)
VDD: C52.1 U7.14(VCC)
IN 1-2: U7.2(IN_1-2) ; port IN 1-2
IN 3-4: U7.10(IN_3-4) ; port IN 3-4
NetU7_1: U7.1(NC1) ; port NC.CH1
NetU7_3: U7.3(NO2) ; port NO.CH2
NetU7_4: U7.4(COM2) ; port COM.CH2
NetU7_5: U7.5(NC2) ; port NC.CH2
NetU7_7: U7.7(NO3) ; port NO.CH3
NetU7_8: U7.8(COM3) ; port COM.CH3
NetU7_9: U7.9(NC3) ; port NC.CH3
NetU7_11: U7.11(NO4) ; port NO.CH4
NetU7_12: U7.12(COM4) ; port COM.CH4
NetU7_13: U7.13(NC4) ; port NC.CH4
NetU7_15: U7.15(NO1) ; port NO.CH1
NetU7_16: U7.16(COM1) ; port COM.CH1

### Channels
/S1: designators end in _S1; ports IN 1-2=VCOM0_CTRL IN 3-4=VCOM1_CTRL
/S2: designators end in _S2; ports IN 1-2=VCOM0_HWFC IN 3-4=VCOM1_HWFC
/S3: designators end in _S3; ports IN 1-2=SWD_CTRL IN 3-4=SWD_CTRL
/S4: designators end in _S4; ports IN 1-2=TGT_TWI_CTRL IN 3-4=IN 3-4
/S5: designators end in _S5; ports IN 1-2=IOEXP_CTRL IN 3-4=IOEXP_CTRL
/S6: designators end in _S6; ports IN 1-2=IOEXP_CTRL IN 3-4=IOEXP_CTRL
/S8: designators end in _S8; ports IN 1-2=EXT_MEM_CTRL IN 3-4=EXT_MEM_CTRL
/S10: designators end in _S10; ports IN 1-2=RESET_OUT_CTRL IN 3-4=RESET_IN_CTRL
/S11: designators end in _S11; ports IN 1-2=COEX_SELECT IN 3-4=COEX_SELECT

### Notes on the sheet
- Title
- Size
- Date:
- File:
- A3
- PCB Assembly Number
- Sheet         of
- Drawn By:
- Revision
- Classification:

### Library data of the parts
C52 = C0201-100n: as C4 on sheet pca10171_nrf9151; Part Number: C0201-100n; Manufacturer Part Number: N.A.; ComponentLink1URL: N.A.; ComponentLink1Description: Datasheet; ComponentLink2URL: N.A.; ComponentLink2Description: Supplier link; HelpURL: N.A.; Footprint Doc: 0201; LatestRevisionDate: 2017-11-09; Published: 2014-11-13; Value: 100nF; Artikkelnr Noca: N.A.; Supplier 1: N.A.; Supplier Part Number 1: N.A.; Supplier 2: N.A.; Supplier Part Number 2: N.A.; Component Class: Capacitors; PartId: 100200078; Author: rsk
U7 = FSA2466UMX: Data / Audio Low-Voltage Dual DPDT Analog Switch; Manufacturer: ON Semiconductor; Part number IPS: 00000009986; Part number Norautron: 26500608; Part number NEMS: 101900422; Note: N.A.; Artikkelnr Noca: 15070069; Pad Count: 16; Component Status: Active; Part Number: FSA2466UMX; Manufacturer Part Number: FSA2466UMX; ComponentLink1URL: N.A.; ComponentLink1Description: Datasheet; ComponentLink2URL: N.A.; ComponentLink2Description: Supplier link; HelpURL: https://www.onsemi.com/pub/Collateral/FSA2466-D.PDF; Footprint Doc: UFQFN-16; LatestRevisionDate: 2019-05-15; Published: 2016-05-18; Value: FSA2466UMX; Supplier 1: Digi-Key; Supplier Part Number 1: FSA2466UMXCT-ND; Supplier 2: Mouser; Supplier Part Number 2: 512-FSA2466UMX; Component Class: Misc_ICs; PartId: 101900422; Author: rsk

## Sheet pca10171_leds_and_buttons.SchDoc: =BoardTitle + ' - LEDs and Buttons'
size A3; Organization: Nordic Semiconductor; DocumentNumber: 4; Revision: 1.0.1; SheetNumber: 4; SheetTotal: 10; Author: KOD1; CompanyName: Nordic Semiconductor; DrawnBy: KOD1; DocumentSize: A3; ProjectName: nRF91 DK
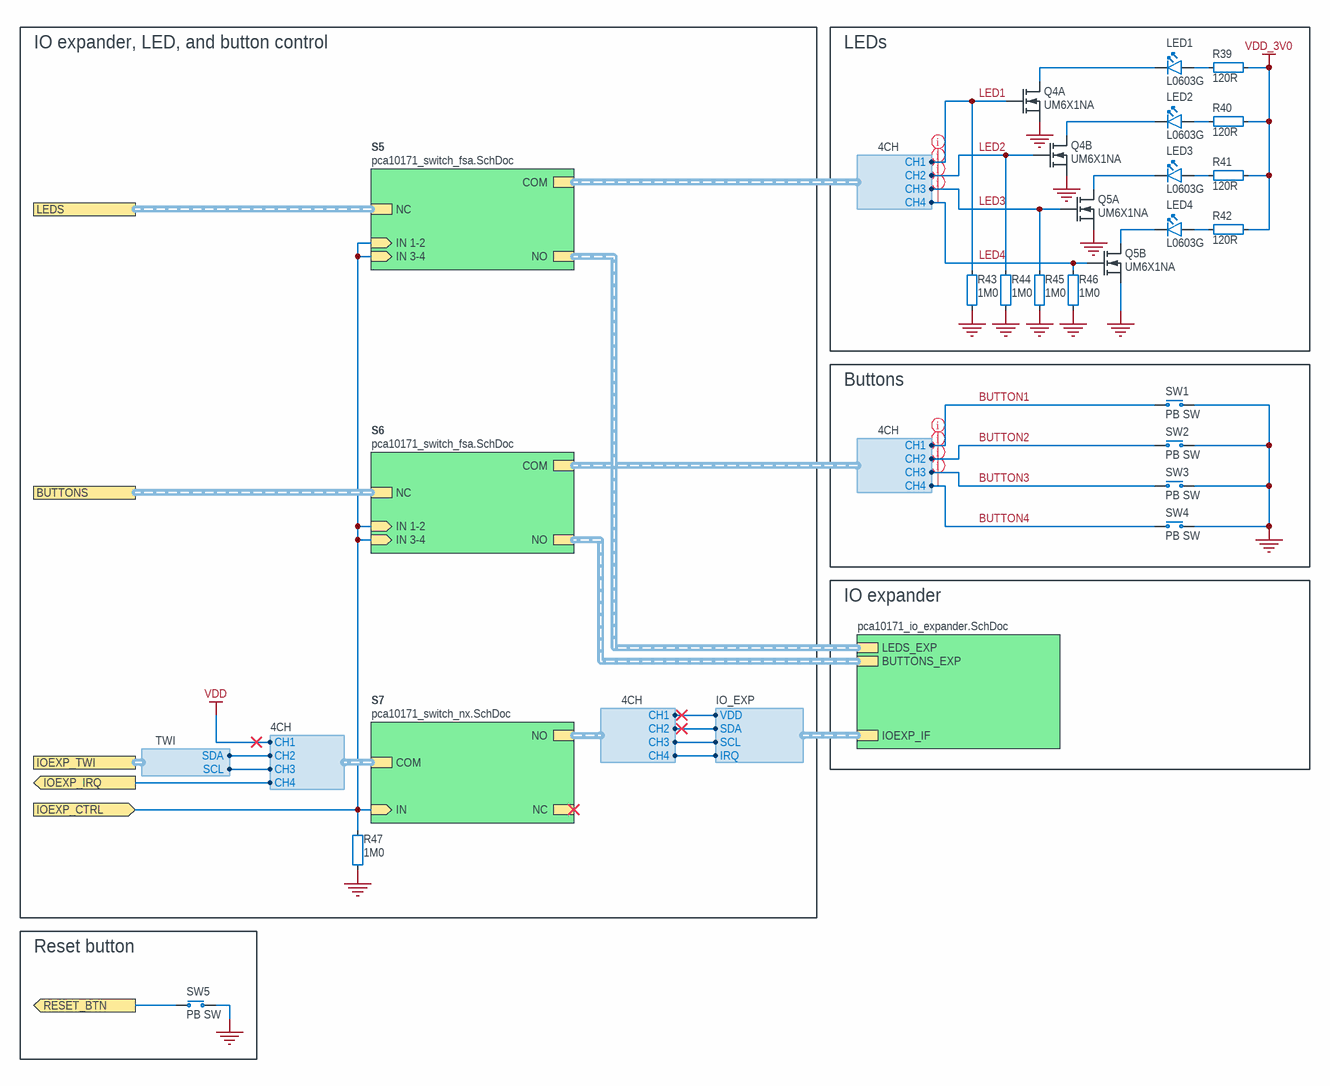
[diagram p4: pca10171_leds_and_buttons.SchDoc]

### Parts
LED1  L0603G  [LED_0603_G]
LED2  L0603G  [LED_0603_G]
LED3  L0603G  [LED_0603_G]
LED4  L0603G  [LED_0603_G]
Q4  UM6X1NA  [SOTFL50P162X60-6N]  (parts A,B of 2)
Q5  UM6X1NA  [SOTFL50P162X60-6N]  (parts A,B of 2)
R39  120R  [RESC0603X03L_C]
R40  120R  [RESC0603X03L_C]
R41  120R  [RESC0603X03L_C]
R42  120R  [RESC0603X03L_C]
R43  1M0  [RESC0603X03L_C]
R44  1M0  [RESC0603X03L_C]
R45  1M0  [RESC0603X03L_C]
R46  1M0  [RESC0603X03L_C]
R47  1M0  [RESC0603X03L_C]
SW1  PB SW  [L-KLS7-TS6616B-2.5-160-T]
SW2  PB SW  [L-KLS7-TS6616B-2.5-160-T]
SW3  PB SW  [L-KLS7-TS6616B-2.5-160-T]
SW4  PB SW  [L-KLS7-TS6616B-2.5-160-T]
SW5  PB SW  [L-KLS7-TS6616B-2.5-160-T]

### Blocks framed on the sheet
IO expander, LED, and button control: R47
LEDs: LED1-LED4 Q4 Q5 R39-R46
Buttons: SW1-SW4
Reset button: SW5

### Sub-sheets
Designator = pca10171_io_expander.SchDoc: LEDS_EXP (harness 4CH), BUTTONS_EXP (harness 4CH), IOEXP_IF (harness IO_EXP)
S5 = pca10171_switch_fsa.SchDoc: IN 1-2 (in), COM (harness 4CH), NC (harness 4CH), NO (harness 4CH), IN 3-4 (in)
S6 = pca10171_switch_fsa.SchDoc: IN 1-2 (in), COM (harness 4CH), NC (harness 4CH), NO (harness 4CH), IN 3-4 (in)
S7 = pca10171_switch_nx.SchDoc: IN (in), COM (harness 4CH), NC (harness 4CH), NO (harness 4CH)

### Ports
BUTTONS (harness 4CH), IOEXP_CTRL (in), IOEXP_IRQ (out), IOEXP_TWI (harness TWI), LEDS (harness 4CH), RESET_BTN (out)

### Harnesses
4CH: CH1, CH2, CH3, CH4
IO_EXP: VDD, SCL, SDA, IRQ
TWI: SCL, SDA

### Nets
GND: Q4.1(S1) Q4.4(S2) Q5.1(S1) Q5.4(S2) R43.1 R44.1 R45.1 R46.1 R47.1 SW1.1(N.O) SW2.1(N.O) SW3.1(N.O) SW4.1(N.O) SW5.1(N.O)
VDD_3V0: R39.2 R40.2 R41.2 R42.2
VIOEXT: sheet S7/NO.CH1, sheet Designator/IOEXP_IF.VDD
BUTTON1: SW1.2(COM) ; sheet S6/COM.CH1
BUTTON2: SW2.2(COM) ; sheet S6/COM.CH2
BUTTON3: SW3.2(COM) ; sheet S6/COM.CH3
BUTTON4: SW4.2(COM) ; sheet S6/COM.CH4
INT_EXT: sheet S7/NO.CH4, sheet Designator/IOEXP_IF.IRQ
IOEXP_CTRL: R47.2 ; port IOEXP_CTRL, sheet S5/IN 1-2, sheet S5/IN 3-4, sheet S6/IN 1-2, sheet S6/IN 3-4, sheet S7/IN
LED1: Q4.2(G1) R43.2 ; sheet S5/COM.CH1
LED2: Q4.5(G2) R44.2 ; sheet S5/COM.CH2
LED3: Q5.2(G1) R45.2 ; sheet S5/COM.CH3
LED4: Q5.5(G2) R46.2 ; sheet S5/COM.CH4
P0.19/AIN6: port IOEXP_IRQ, sheet S7/COM.CH4
P0.30: sheet S7/COM.CH2, port IOEXP_TWI.SDA
P0.31: sheet S7/COM.CH3, port IOEXP_TWI.SCL
RESET_BUTTON: SW5.2(COM) ; port RESET_BTN
SCL_EXT: sheet S7/NO.CH3, sheet Designator/IOEXP_IF.SCL
SDA_EXT: sheet S7/NO.CH2, sheet Designator/IOEXP_IF.SDA
NetLED1_1: LED1.1(C) Q4.6(D1)
NetLED1_2: LED1.2(A) R39.1
NetLED2_1: LED2.1(C) Q4.3(D2)
NetLED2_2: LED2.2(A) R40.1
NetLED3_1: LED3.1(C) Q5.6(D1)
NetLED3_2: LED3.2(A) R41.1
NetLED4_1: LED4.1(C) Q5.3(D2)
NetLED4_2: LED4.2(A) R42.1

### Buses and harness runs
harness port BUTTONS = sheet S6/NC
harness port LEDS = sheet S5/NC
harness sheet Designator/BUTTONS_EXP = sheet S6/NO
harness sheet Designator/LEDS_EXP = sheet S5/NO

### Layout directives
net class GPIO: BUTTON1, BUTTON2, BUTTON3, BUTTON4, LED1, LED2, LED3, LED4

### Notes on the sheet
- IO expander
- Title
- Size
- Date:
- File:
- A3
- PCB Assembly Number
- Sheet         of
- Drawn By:
- Revision
- Classification:

### Library data of the parts
LED1-LED4 = VS 25C7M5: as LED5 on sheet pca10171_interface_mcu; Part Number: VS 25C7M5; Manufacturer Part Number: VS 25C7M5; Footprint Doc: 0603; LatestRevisionDate: 2020-10-23; Published: 2017-08-21; Value: L0603G; ComponentLink1URL: N.A.; ComponentLink1Description: Datasheet; ComponentLink2URL: N.A.; ComponentLink2Description: Supplier link; HelpURL: \\hizz\pro\app9717\Datasheet\optoelectronics\Victory Electronics\VS 25C7M5.pdf; Supplier 1: EC Partner; Supplier Part Number 1: N.A.; Supplier 2: N.A.; Supplier Part Number 2: N.A.; PartId: 101400097; Component Class: Optoelectronics; Author: rsk
Q4 Q5 = UM6X1NA: Dual N-Channel MOSFET, Vds = 30V, Vgs(th) = 1.5V, Id = 0.5A, Rds = 750mOhm, Pd = 150mW; Manufacturer: Micro Commercial Components; Manufacturer Part Number: UM6X1NA-TP; Part number NEMS: 101300201; Note: N.A.; Pad Count: 6; Component Status: Active; Part Number: UM6X1NA; ComponentLink1URL: https://www.mccsemi.com/pdf/Products/UM6X1NA(SOT-563).pdf; ComponentLink1Description: Datasheet; ComponentLink2URL: https://www.digikey.com/en/products/detail/micro-commercial-co/UM6X1NA-TP/16399159; ComponentLink2Description: Supplier link; HelpURL: https://www.mccsemi.com/product-detail/UM6X1NA; Footprint Doc: SOT-563; LatestRevisionDate: 2023-01-19; Published: 2023-01-19; Value: UM6X1NA; Supplier 1: Digi-Key; Supplier Part Number 1: 353-UM6X1NA-TPCT-ND; Supplier 2: Mouser; Supplier Part Number 2: 833-UM6X1NA-TP; Artikkelnr Noca: N.A.; Part number IPS: N.A.; Component Class: Semiconductors; Author: rubr; Part number Norautron: N.A.; PartId: 101300201
R39-R42 = R0201-120: as R33 on sheet pca10171_interface_mcu; Part Number: R0201-120; Manufacturer Part Number: N.A.; ComponentLink1URL: N.A.; ComponentLink1Description: Datasheet; ComponentLink2URL: N.A.; ComponentLink2Description: Supplier link; HelpURL: N.A.; Footprint Doc: 0201; LatestRevisionDate: 2014-11-13; Published: 2014-11-13; Value: 120R; Supplier 1: N.A.; Supplier Part Number 1: N.A.; Supplier 2: N.A.; Supplier Part Number 2: N.A.; Artikkelnr Noca: N.A.; PartId: 100100028; Component Class: Resistors; Author: rsk
R43-R47 = R0201-1M0: as R3 on sheet pca10171_nrf9151; Part Number: R0201-1M0; Manufacturer Part Number: N.A.; ComponentLink1URL: N.A.; ComponentLink1Description: Datasheet; ComponentLink2URL: N.A.; ComponentLink2Description: Supplier link; HelpURL: N.A.; Footprint Doc: 0201; LatestRevisionDate: 2014-11-13; Published: 2014-11-13; Value: 1M0; Supplier 1: N.A.; Supplier Part Number 1: N.A.; Supplier 2: N.A.; Supplier Part Number 2: N.A.; Artikkelnr Noca: N.A.; PartId: 100100093; Component Class: Resistors; Author: rsk
SW1-SW5 = L-KLS7-TS6616B-2.5-160-T: Tactile Switch, SPNO, SMD, 160gf, 6.2x6.4x2.5mm; Manufacturer: KLS; Part number NEMS: 101500133, 101500001; Note: N.A.; Pad Count: 4; Component Status: Active; Part Number: L-KLS7-TS6616B-2.5-160-T; Manufacturer Part Number: L-KLS7-TS6616B-2.5-160-T; LatestRevisionDate: 2021-07-02; Published: 2021-07-02; Value: PB SW; Artikkelnr Noca: N.A.; ComponentLink1URL: N.A.; ComponentLink1Description: Datasheet; ComponentLink2URL: N.A.; ComponentLink2Description: Supplier link; HelpURL: \\hizz\pro\app9717\Datasheet\switches\KLS\L-KLS7-TS6616B-2.5-160-T.pdf; Footprint Doc: L-KLS7-TS6616B-2.5-160-T; Supplier 1: Cabcon; Supplier Part Number 1: L-KLS7-TS6616B-2.5-160-T; Supplier 2: N.A.; Supplier Part Number 2: N.A.; Part number IPS: N.A.; PartId: 101500133; Component Class: Switches; Author: masi; Part number Norautron: N.A.

## Sheet pca10171_switch_nx.SchDoc: =BoardTitle + ' - Switch NX'
size A3; Organization: Nordic Semiconductor; DocumentNumber: 10; Revision: 1.0.1; SheetNumber: 10; SheetTotal: 10; Author: KOD1; CompanyName: Nordic Semiconductor; DrawnBy: KOD1; DocumentSize: A4; ProjectName: nRF91 DK
Used 2 times, as channels /S7, /S9. Parts and nets are listed once, with the designators drawn on the sheet.
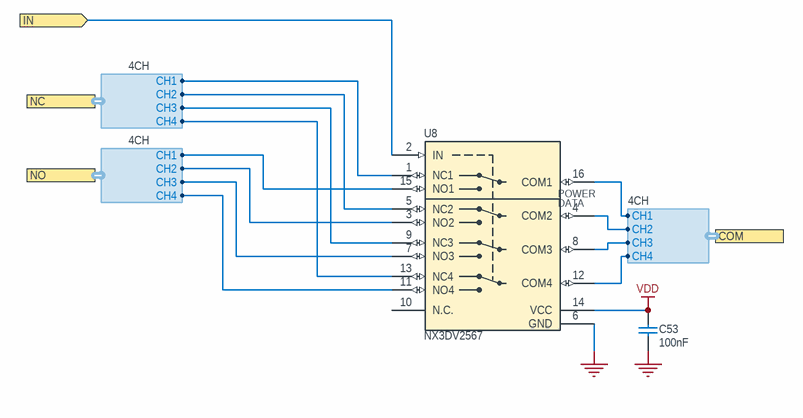
[diagram p5: pca10171_switch_nx.SchDoc]

### Parts
C53  100nF  [CAPC0603X03L_C]
U8  NX3DV2567  [XQFN40P180X260X50-16N]

### Ports
COM (harness 4CH), IN (in), NC (harness 4CH), NO (harness 4CH)

### Harnesses
4CH: CH1, CH2, CH3, CH4

### Nets
GND: C53.2 U8.6(GND)
VDD: C53.1 U8.14(VCC)
IN: U8.2(IN) ; port IN
NetU8_1: U8.1(NC1) ; port NC.CH1
NetU8_3: U8.3(NO2) ; port NO.CH2
NetU8_4: U8.4(COM2) ; port COM.CH2
NetU8_5: U8.5(NC2) ; port NC.CH2
NetU8_7: U8.7(NO3) ; port NO.CH3
NetU8_8: U8.8(COM3) ; port COM.CH3
NetU8_9: U8.9(NC3) ; port NC.CH3
NetU8_11: U8.11(NO4) ; port NO.CH4
NetU8_12: U8.12(COM4) ; port COM.CH4
NetU8_13: U8.13(NC4) ; port NC.CH4
NetU8_15: U8.15(NO1) ; port NO.CH1
NetU8_16: U8.16(COM1) ; port COM.CH1

Not connected (* = marked no-connect by the designer): U8 10(N.C.)

### Channels
/S7: designators end in _S7; ports IN=IOEXP_CTRL
/S9: designators end in _S9; ports IN=SIM_SELECT

### Notes on the sheet
- Title
- Size
- Date:
- File:
- A3
- PCB Assembly Number
- Sheet         of
- Drawn By:
- Revision
- Classification:
- (in symbol NX3DV2567GU) POWER; DATA

### Library data of the parts
C53 = C0201-100n: as C4 on sheet pca10171_nrf9151; Part Number: C0201-100n; Manufacturer Part Number: N.A.; ComponentLink1URL: N.A.; ComponentLink1Description: Datasheet; ComponentLink2URL: N.A.; ComponentLink2Description: Supplier link; HelpURL: N.A.; Footprint Doc: 0201; LatestRevisionDate: 2017-11-09; Published: 2014-11-13; Value: 100nF; Artikkelnr Noca: N.A.; Supplier 1: N.A.; Supplier Part Number 1: N.A.; Supplier 2: N.A.; Supplier Part Number 2: N.A.; Component Class: Capacitors; PartId: 100200078; Author: rsk
U8 = NX3DV2567GU: Low-ohmic four-pole double-throw analog switch; Manufacturer: NXP Semiconductors; Part number IPS: 00000007816; Part number NEMS: 101900290; Note: N.A.; Artikkelnr Noca: 15079317; Pad Count: 16; Component Status: Active; Part Number: NX3DV2567GU; Manufacturer Part Number: NX3DV2567GU; Footprint Doc: XQFN-16; LatestRevisionDate: 2015-02-17; Published: 2015-02-17; Value: NX3DV2567; ComponentLink1URL: N.A.; ComponentLink1Description: Datasheet; ComponentLink2URL: N.A.; ComponentLink2Description: Supplier link; HelpURL: http://www.nxp.com/documents/data_sheet/NX3DV2567.pdf; Supplier 1: Digi-Key; Supplier Part Number 1: 568-5206-1-ND; Supplier 2: Mouser; Supplier Part Number 2: 771-NX3DV2567GU115; PartId: 101900290; Component Class: Misc_ICs; Author: rsk; Part number Norautron: N.A.

## Sheet pca10171_io_expander.SchDoc: =BoardTitle + ' - IO Expander'
size A3; Organization: Nordic Semiconductor; DocumentNumber: 5; Revision: 1.0.1; SheetNumber: 5; SheetTotal: 10; Author: KOD1; CompanyName: Nordic Semiconductor; DrawnBy: KOD1; DocumentSize: A3; ProjectName: nRF91 DK
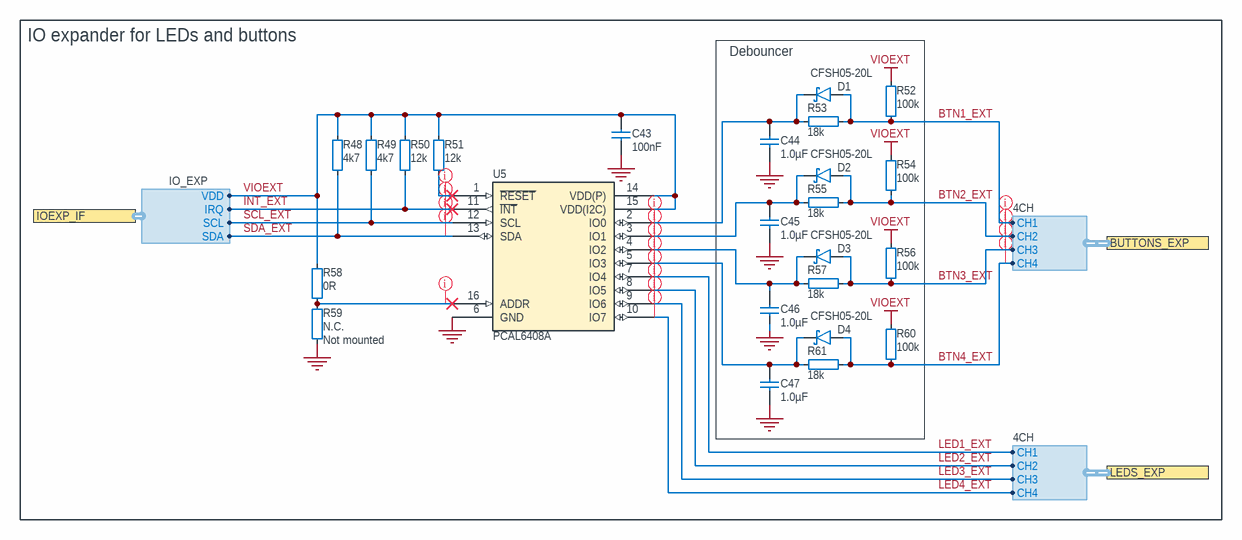
[diagram p6: pca10171_io_expander.SchDoc]

### Parts
C43  100nF  [CAPC0603X03L_C]
C44  1.0µF  [CAPC0603X03L_C]
C45  1.0µF  [CAPC0603X03L_C]
C46  1.0µF  [CAPC0603X03L_C]
C47  1.0µF  [CAPC0603X03L_C]
D1  CFSH05-20L  [SODFL35X40-2N]
D2  CFSH05-20L  [SODFL35X40-2N]
D3  CFSH05-20L  [SODFL35X40-2N]
D4  CFSH05-20L  [SODFL35X40-2N]
R48  4k7  [RESC0603X03L_C]
R49  4k7  [RESC0603X03L_C]
R50  12k  [RESC0603X03L_C]
R51  12k  [RESC0603X03L_C]
R52  100k  [RESC0603X03L_C]
R53  18k  [RESC0603X03L_C]
R54  100k  [RESC0603X03L_C]
R55  18k  [RESC0603X03L_C]
R56  100k  [RESC0603X03L_C]
R57  18k  [RESC0603X03L_C]
R58  0R  [RESC0603X03L_C]
R59  N.C.  Assembly: Not mounted  [RESC0603X03L_C_NC]
R60  100k  [RESC0603X03L_C]
R61  18k  [RESC0603X03L_C]
U5  PCAL6408A  [XQFN40P180X260X50-16N]

### Blocks framed on the sheet
IO expander for LEDs and buttons: C43 R48-R51 R58 R59 U5
Debouncer: C44-C47 D1-D4 R52-R57 R60 R61

### Ports
BUTTONS_EXP (harness 4CH), IOEXP_IF (harness IO_EXP), LEDS_EXP (harness 4CH)

### Harnesses
IO_EXP: VDD, SCL, SDA, IRQ
4CH: CH1, CH2, CH3, CH4

### Nets
GND: C43.1 C44.2 C45.1 C46.1 C47.1 R59.1 U5.6(GND)
VIOEXT: C43.2 R48.2 R49.2 R50.2 R51.2 R52.2 R54.2 R56.2 R58.2 R60.2 U5.14(VDD(P)) U5.15(VDD(I2C)) ; port IOEXP_IF.VDD
BTN1_EXT: D1.1(A) R52.1 R53.2 ; port BUTTONS_EXP.CH1
BTN2_EXT: D2.1(A) R54.1 R55.2 ; port BUTTONS_EXP.CH2
BTN3_EXT: D3.1(A) R56.1 R57.2 ; port BUTTONS_EXP.CH3
BTN4_EXT: D4.1(A) R60.1 R61.2 ; port BUTTONS_EXP.CH4
INT_EXT: R50.1 U5.11(~{INT}) ; port IOEXP_IF.IRQ
LED1_EXT: U5.7(IO4) ; port LEDS_EXP.CH1
LED2_EXT: U5.8(IO5) ; port LEDS_EXP.CH2
LED3_EXT: U5.9(IO6) ; port LEDS_EXP.CH3
LED4_EXT: U5.10(IO7) ; port LEDS_EXP.CH4
SCL_EXT: R49.1 U5.12(SCL) ; port IOEXP_IF.SCL
SDA_EXT: R48.1 U5.13(SDA) ; port IOEXP_IF.SDA
NetC44_1: C44.1 D1.3(C) R53.1 U5.2(IO0)
NetC45_2: C45.2 D2.3(C) R55.1 U5.3(IO1)
NetC46_2: C46.2 D3.3(C) R57.1 U5.4(IO2)
NetC47_2: C47.2 D4.3(C) R61.1 U5.5(IO3)
NetR51_1: R51.1 U5.1(~{RESET})
NetR58_1: R58.1 R59.2 U5.16(ADDR)

### Layout directives
net class GPIO: BTN1_EXT, BTN2_EXT, BTN3_EXT, BTN4_EXT, INT_EXT, LED1_EXT, LED2_EXT, LED3_EXT, LED4_EXT, NetC44_1, NetC45_2, NetC46_2, NetC47_2, NetR51_1, NetR58_1, SCL_EXT, SDA_EXT

### Notes on the sheet
- Title
- Size
- Date:
- File:
- A3
- PCB Assembly Number
- Sheet         of
- Drawn By:
- Revision
- Classification:

### Library data of the parts
C43 = C0201-100n: as C4 on sheet pca10171_nrf9151; Part Number: C0201-100n; Manufacturer Part Number: N.A.; Footprint Doc: 0201; LatestRevisionDate: 2017-11-09; Published: 2014-11-13; Value: 100nF; Artikkelnr Noca: N.A.; ComponentLink1URL: N.A.; ComponentLink1Description: Datasheet; ComponentLink2URL: N.A.; ComponentLink2Description: Supplier link; HelpURL: N.A.; Supplier 1: N.A.; Supplier Part Number 1: N.A.; Supplier 2: N.A.; Supplier Part Number 2: N.A.; PartId: 100200078; Component Class: Capacitors; Author: rsk
C44-C47 = C0201-1µ0: Capacitor, X5R, ±10%; Manufacturer: N.A.; Part number IPS: 00000001723; Part number NEMS: 100200084; Note: 10V; Pad Count: 2; Component Status: Active; Part Number: C0201-1µ0; Manufacturer Part Number: N.A.; Footprint Doc: 0201; LatestRevisionDate: 2016-08-22; Published: 2009-05-08; Value: 1.0µF; Artikkelnr Noca: N.A.; ComponentLink1URL: N.A.; ComponentLink1Description: Datasheet; ComponentLink2URL: N.A.; ComponentLink2Description: Supplier link; HelpURL: N.A.; Supplier 1: Digi-Key; Supplier Part Number 1: 1276-6795-1-ND; Supplier 2: N.A.; Supplier Part Number 2: N.A.; PartId: 100200084; Component Class: Capacitors; Author: rsk; Part number Norautron: N.A.
D1-D4 = CFSH05-20L: DIODE SCHOTTKY 20V 500MA SOD882; Manufacturer: Central Semiconductor Corp.; Part number IPS: 00000002493; Part number NEMS: 101300101; Note: N.A.; Pad Count: 2; Component Status: Active; Part Number: CFSH05-20L; Manufacturer Part Number: CFSH05-20L; Footprint Doc: SOD-882L; LatestRevisionDate: 2015-01-30; Published: 2015-01-30; Value: CFSH05-20L; Artikkelnr Noca: N.A.; ComponentLink1URL: N.A.; ComponentLink1Description: Datasheet; ComponentLink2URL: N.A.; ComponentLink2Description: Supplier link; HelpURL: http://www.centralsemi.com/PDFs/products/CFSH05-20L.PDF; Supplier 1: Digi-Key; Supplier Part Number 1: CFSH05-20L CT-ND; Supplier 2: N.A.; Supplier Part Number 2: N.A.; PartId: 101300101; Component Class: Semiconductors; Author: rsk; Part number Norautron: N.A.
R48 R49 = R0201-4k7: Resistor, ±1%, 0.05W; Manufacturer: N.A.; Part number IPS: 00000001706; Part number NEMS: 100100061; Note: Chip Res 1%; Pad Count: 2; Component Status: Active; Part Number: R0201-4k7; Manufacturer Part Number: N.A.; Footprint Doc: 0201; LatestRevisionDate: 2014-11-13; Published: 2014-11-13; Value: 4k7; Artikkelnr Noca: N.A.; ComponentLink1URL: N.A.; ComponentLink1Description: Datasheet; ComponentLink2URL: N.A.; ComponentLink2Description: Supplier link; HelpURL: N.A.; Supplier 1: N.A.; Supplier Part Number 1: N.A.; Supplier 2: N.A.; Supplier Part Number 2: N.A.; PartId: 100100061; Component Class: Resistors; Author: rsk; Part number Norautron: N.A.
R50 R51 = R0201-12k: Resistor, ±1%, 0.05W; Manufacturer: N.A.; Part number IPS: 00000007891; Part number Norautron: 26192279; Part number NEMS: 100100066; Note: Chip Res 1%; Pad Count: 2; Component Status: Active; Part Number: R0201-12k; Manufacturer Part Number: N.A.; Footprint Doc: 0201; LatestRevisionDate: 2014-11-13; Published: 2014-11-13; Value: 12k; Artikkelnr Noca: N.A.; ComponentLink1URL: N.A.; ComponentLink1Description: Datasheet; ComponentLink2URL: N.A.; ComponentLink2Description: Supplier link; HelpURL: N.A.; Supplier 1: N.A.; Supplier Part Number 1: N.A.; Supplier 2: N.A.; Supplier Part Number 2: N.A.; PartId: 100100066; Component Class: Resistors; Author: rsk
R52 R54 R56 R60 = R0201-100k: as R34 on sheet pca10171_interface_mcu; Part Number: R0201-100k; Manufacturer Part Number: N.A.; Footprint Doc: 0201; LatestRevisionDate: 2014-11-13; Published: 2014-11-13; Value: 100k; Artikkelnr Noca: N.A.; ComponentLink1URL: N.A.; ComponentLink1Description: Datasheet; ComponentLink2URL: N.A.; ComponentLink2Description: Supplier link; HelpURL: N.A.; Supplier 1: N.A.; Supplier Part Number 1: N.A.; Supplier 2: N.A.; Supplier Part Number 2: N.A.; PartId: 100100080; Component Class: Resistors; Author: rsk
R53 R55 R57 R61 = R0201-18k: Resistor, ±1%, 0.05W; Manufacturer: N.A.; Part number IPS: 00000001707; Part number NEMS: 100100069; Note: Chip Res 1%; Pad Count: 2; Component Status: Active; Part Number: R0201-18k; Manufacturer Part Number: N.A.; Footprint Doc: 0201; LatestRevisionDate: 2014-11-13; Published: 2014-11-13; Value: 18k; Artikkelnr Noca: N.A.; ComponentLink1URL: N.A.; ComponentLink1Description: Datasheet; ComponentLink2URL: N.A.; ComponentLink2Description: Supplier link; HelpURL: N.A.; Supplier 1: N.A.; Supplier Part Number 1: N.A.; Supplier 2: N.A.; Supplier Part Number 2: N.A.; PartId: 100100069; Component Class: Resistors; Author: rsk; Part number Norautron: N.A.
R58 = R0201-0R: Resistor, ±5%, 0.05W; Manufacturer: N.A.; Part number IPS: 00000003245; Part number NEMS: 100100001; Note: Chip Res 5%; Pad Count: 2; Component Status: Active; Part Number: R0201-0R; Manufacturer Part Number: N.A.; Footprint Doc: 0201; LatestRevisionDate: 2017-11-09; Published: 2014-11-13; Value: 0R; Artikkelnr Noca: N.A.; ComponentLink1URL: N.A.; ComponentLink1Description: Datasheet; ComponentLink2URL: N.A.; ComponentLink2Description: Supplier link; HelpURL: N.A.; Supplier 1: N.A.; Supplier Part Number 1: N.A.; Supplier 2: N.A.; Supplier Part Number 2: N.A.; PartId: 100100001; Component Class: Resistors; Author: rsk; Part number Norautron: N.A.
R59 = R0201-N.C.: Not mounted; Manufacturer: N.A.; Part number NEMS: 100100107; Note: Chip Res; Pad Count: 2; Component Status: Active; Part Number: R0201-N.C.; Manufacturer Part Number: N.A.; Footprint Doc: 0201; LatestRevisionDate: 2014-11-13; Published: 2014-11-13; Value: N.C.; Artikkelnr Noca: N.A.; Part number IPS: N.A.; ComponentLink1URL: N.A.; ComponentLink1Description: Datasheet; ComponentLink2URL: N.A.; ComponentLink2Description: Supplier link; HelpURL: N.A.; Supplier 1: N.A.; Supplier Part Number 1: N.A.; Supplier 2: N.A.; Supplier Part Number 2: N.A.; PartId: 100100107; Component Class: Resistors; Author: rsk; Part number Norautron: N.A.
U5 = PCAL6408AHK: 8-bit I2C-bus I/O expander with interrupt output; Manufacturer: NXP Semiconductors; Part number IPS: 00000009987; Part number NEMS: 101900289; Note: N.A.; Artikkelnr Noca: 15079321; Pad Count: 16; Component Status: Active; Part Number: PCAL6408AHK; Manufacturer Part Number: PCAL6408AHK; Footprint Doc: XQFN-16; LatestRevisionDate: 2015-04-29; Published: 2015-04-29; Value: PCAL6408A; ComponentLink1URL: N.A.; ComponentLink1Description: Datasheet; ComponentLink2URL: N.A.; ComponentLink2Description: Supplier link; HelpURL: http://www.nxp.com/documents/data_sheet/PCAL6408A.pdf; Supplier 1: Digi-Key; Supplier Part Number 1: 568-9944-1-ND; Supplier 2: Mouser; Supplier Part Number 2: 771-PCAL6408AHKX; PartId: 101900289; Component Class: Misc_ICs; Author: rsk; Part number Norautron: N.A.

## Sheet pca10171_memory.SchDoc: =BoardTitle + ' - Memory'
size A3; Organization: Nordic Semiconductor; DocumentNumber: 6; Revision: 1.0.1; SheetNumber: 6; SheetTotal: 10; Author: KOD1; CompanyName: Nordic Semiconductor; DrawnBy: KOD1; DocumentSize: A3; ProjectName: nRF91 DK
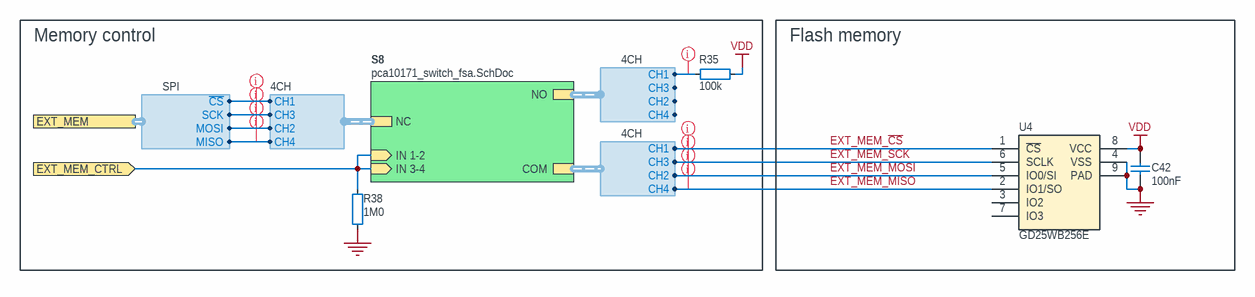
[diagram p7: pca10171_memory.SchDoc]

### Parts
C42  100nF  [CAPC0603X03L_C]
R35  100k  [RESC0603X03L_C]
R38  1M0  [RESC0603X03L_C]
U4  GD25WB256E  [SON127P800X80_HS-9N]

### Blocks framed on the sheet
Memory control: R35 R38
Flash memory: C42 U4

### Sub-sheets
S8 = pca10171_switch_fsa.SchDoc: IN 1-2 (in), COM (harness 4CH), NC (harness 4CH), NO (harness 4CH), IN 3-4 (in)

### Ports
EXT_MEM (harness SPI), EXT_MEM_CTRL (in)

### Harnesses
4CH: CH1, CH2, CH3, CH4
SPI: SCK, ~{CS}, MOSI, MISO

### Nets
GND: C42.1 R38.1 U4.4(VSS) U4.9(PAD)
VDD: C42.2 R35.2 U4.8(VCC)
EXT_MEM_~{CS}: U4.1(~{CS}) ; sheet S8/COM.CH1
EXT_MEM_CTRL: R38.2 ; port EXT_MEM_CTRL, sheet S8/IN 1-2, sheet S8/IN 3-4
EXT_MEM_MISO: U4.2(IO1/SO) ; sheet S8/COM.CH4
EXT_MEM_MOSI: U4.5(IO0/SI) ; sheet S8/COM.CH2
EXT_MEM_SCK: U4.6(SCLK) ; sheet S8/COM.CH3
P0.11: port EXT_MEM.MOSI, sheet S8/NC.CH2
P0.12: port EXT_MEM.MISO, sheet S8/NC.CH4
P0.13/AIN0: port EXT_MEM.SCK, sheet S8/NC.CH3
P0.20/AIN7: port EXT_MEM.~{CS}, sheet S8/NC.CH1
NetR35_1: R35.1 ; sheet S8/NO.CH1

Not connected (* = marked no-connect by the designer): U4 3(IO2) 7(IO3)

### Layout directives
net class GPIO: EXT_MEM_MISO, EXT_MEM_MOSI, EXT_MEM_SCK, EXT_MEM_~{CS}, NetR35_1, P0.11, P0.12, P0.13/AIN0, P0.20/AIN7

### Notes on the sheet
- Title
- Size
- Date:
- File:
- A3
- PCB Assembly Number
- Sheet         of
- Drawn By:
- Revision
- Classification:

### Library data of the parts
C42 = C0201-100n: Capacitor, X5R, ±10%; Manufacturer: N.A.; Part number IPS: 00000001248, 00000002505; Part number Norautron: 262071862; Part number NEMS: 100200078; Note: 16V; Pad Count: 2; Component Status: Active; Part Number: C0201-100n; Manufacturer Part Number: N.A.; LatestRevisionDate: 2017-11-09; Published: 2014-11-13; Value: 100nF; Artikkelnr Noca: N.A.; Footprint Doc: 0201; ComponentLink1URL: N.A.; ComponentLink1Description: Datasheet; ComponentLink2URL: N.A.; ComponentLink2Description: Supplier link; HelpURL: N.A.; Supplier 1: N.A.; Supplier Part Number 1: N.A.; Supplier 2: N.A.; Supplier Part Number 2: N.A.; PartId: 100200078; Component Class: Capacitors; Author: rsk
R35 = R0201-100k: Resistor, ±1%, 0.05W; Manufacturer: N.A.; Part number IPS: 00000001419; Part number Norautron: 26108487; Part number NEMS: 100100080; Pad Count: 2; Note: Chip Res 1%; Component Status: Active; Part Number: R0201-100k; PartId: 100100080; Component Class: Resistors; Author: rsk; Manufacturer Part Number: N.A.; ComponentLink1URL: N.A.; ComponentLink1Description: Datasheet; ComponentLink2URL: N.A.; ComponentLink2Description: Supplier link; HelpURL: N.A.; Footprint Doc: 0201; LatestRevisionDate: 2014-11-13; Published: 2014-11-13; Value: 100k; Supplier 1: N.A.; Supplier Part Number 1: N.A.; Supplier 2: N.A.; Supplier Part Number 2: N.A.; Artikkelnr Noca: N.A.
R38 = R0201-1M0: Resistor, ±1%, 0.05W; Manufacturer: N.A.; Part number IPS: 00000001418; Part number Norautron: 26107108; Part number NEMS: 100100093; Note: Chip Res 1%; Pad Count: 2; Component Status: Active; Part Number: R0201-1M0; Manufacturer Part Number: N.A.; ComponentLink1URL: N.A.; ComponentLink1Description: Datasheet; ComponentLink2URL: N.A.; ComponentLink2Description: Supplier link; HelpURL: N.A.; Footprint Doc: 0201; LatestRevisionDate: 2014-11-13; Published: 2014-11-13; Value: 1M0; Artikkelnr Noca: N.A.; Supplier 1: N.A.; Supplier Part Number 1: N.A.; Supplier 2: N.A.; Supplier Part Number 2: N.A.; PartId: 100100093; Component Class: Resistors; Author: rsk
U4 = GD25WB256EYIG: Quad Serial Flash, 256Mbit, 104MHz, 1.65V - 3.6V; Manufacturer: GigaDevice; Part number NEMS: 101900774; Note: N.A.; Pad Count: 8; Component Status: Active; Part Number: GD25WB256EYIG; Manufacturer Part Number: GD25WB256EYIG; Footprint Doc: WSON-8; LatestRevisionDate: 2023-03-27; Published: 2023-03-27; Value: GD25WB256E; Artikkelnr Noca: N.A.; Part number IPS: N.A.; ComponentLink1URL: https://www.gigadevice.com.cn/Public/Uploads/uploadfile/files/20220714/DS-00863-GD25WB256E-Rev1.1.pdf; ComponentLink1Description: Datasheet; ComponentLink2URL: N.A.; ComponentLink2Description: Supplier link; HelpURL: https://www.gigadevice.com/product/flash/product-series/spi-nor-flash/gd25wb256e.html; Supplier 1: N.A.; Supplier Part Number 1: N.A.; Supplier 2: N.A.; Supplier Part Number 2: N.A.; Author: rubr; Component Class: Misc_ICs; Part number Norautron: N.A.; PartId: 101900774